# EAGLE design TS5A23166DCUR_breakout (EAGLE 8.5.1)
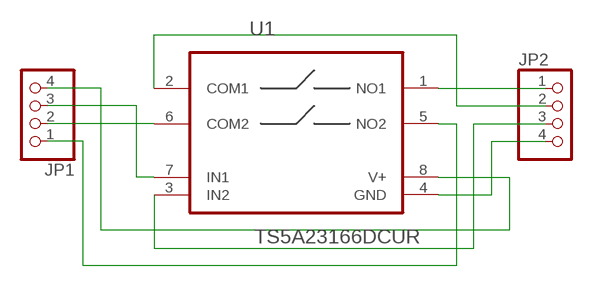
[diagram p0: schematic, sheet 1]

## Parts
JP1  PINHD-1X4  [1X04]
JP2  PINHD-1X4  [1X04]
U1  TS5A23166DCUR  [SOP50P310X90-8N]

## Nets
COM1: JP2.2 U1.2(COM1)
COM2: JP1.2 U1.6(COM2)
GND: JP2.4 U1.4(GND)
IN1: JP1.3 U1.7(IN1)
IN2: JP2.3 U1.3(IN2)
NO1: JP2.1 U1.1(NO1)
NO2: JP1.1 U1.5(NO2)
VCC: JP1.4 U1.8(V+)

## Library data of the parts
JP1 JP2 = pinhead:PINHD-1X4: PIN HEADER
U1 = TS5A2316XDCUR:TS5A23166DCUR: SPST ANALOG SWITCH; AVAILABILITY: Good; DESCRIPTION: 0.9-Ohm Dual SPST Analog Switch 5-V/3.3-V 2-Channel Analog Switch 8-VSSOP -40 to 85; MF: Texas Instruments; MP: TS5A23166DCUR; PACKAGE: VFSOP-8 Texas Instruments; PRICE: 0.46 USD

## Board
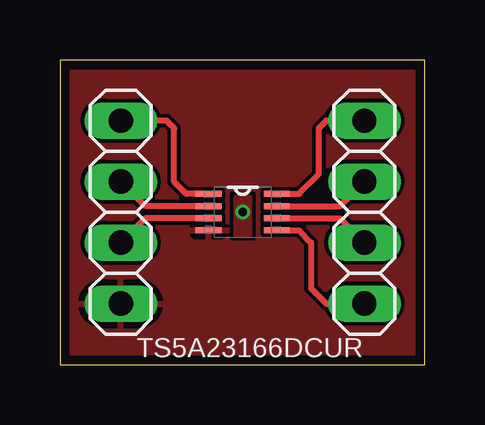
[diagram p1: board, top side]
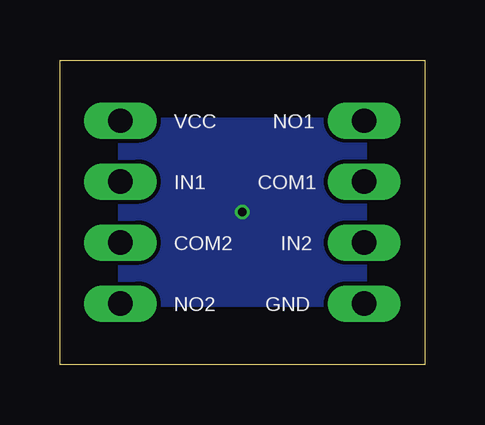
[diagram p2: board, bottom side, seen from below]

Size 15.23 x 12.69 mm. Coordinates in mm from the lower left corner, seen from the top.
Outline: 0,0 15.23,0 15.23,12.69 0,12.69 0,0
Copper layers (1*16): Top 0.035559375mm / dielectric 1.6mm / Bottom 0.035559375mm
Design rules "oshpark-2layer": minimum track width 6mil, minimum drill 10mil, track to track 6mil, track to pad 6mil, pad to pad 6mil, via to via 6mil, smd to smd 6mil, copper to edge 15mil, drill to drill 6mil, minimum pad ring 5mil, minimum via ring 5mil, stop-mask expansion 2.5mil, vias tented up to drill 0mil, thermal gap 10mil

### Footprints (pad centres in the part's own frame; a part is rotated, then mirrored left to right if it is on the bottom)
1X04 = drill 1.016 long: 1 -3.81,0; 2 -1.27,0; 3 1.27,0; 4 3.81,0
SOP50P310X90-8N = smd 1.067 x 0.254: 1 -1.422,0.762; 2 -1.422,0.254; 3 -1.422,-0.254; 4 -1.422,-0.762; 5 1.422,-0.762; 6 1.422,-0.254; 7 1.422,0.254; 8 1.422,0.762

### Placement (x,y rotation side)
JP1  12.7,6.35 90 top
JP2  2.54,6.35 270 top
U1  7.62,6.35 0 top

### Tracks (layer width: path | path; a pad name or v marks a point on that pad's centre or on a via)
COM1
  Top 0.254: U1.2 3.56,6.6 JP2.2
COM2
  Top 0.254: U1.6 11.68,6.1 JP1.2
GND
  pour Top (rank 2): 0,0 15.24,0 15.24,12.7 0,12.7
HEAT  (via drill 0.35)
  other vias: 7.62,6.35
  pour Top: 7.3,6.99 7.94,6.99 7.94,5.4 7.3,5.4
  pour Bottom: 2.54,10.16 12.7,10.16 12.7,2.54 2.54,2.54
IN1
  Top 0.254: U1.7 11.68,6.6 JP1.3
IN2
  Top 0.254: U1.3 3.56,6.1 JP2.3
NO1
  Top 0.254: U1.1 5.27,7.11 4.76,7.62 4.76,9.84 4.45,10.16 JP2.1
NO2
  Top 0.254: U1.5 9.97,5.59 10.48,5.08 10.48,3.17 11.11,2.54 JP1.1
VCC
  Top 0.254: U1.8 9.97,7.11 10.79,7.94 10.79,9.84 11.11,10.16 JP1.4

### Text on the board
bPlace: NO1 | VCC | COM1 | IN1 | IN2 | COM2 | GND | NO2